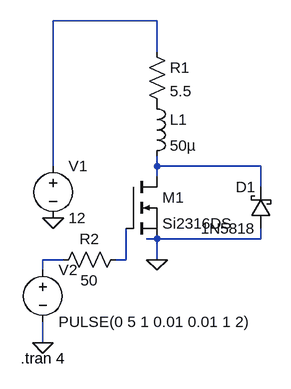
[diagram p0: schematic simu transitor.asc]
simu transitor.asc, the LTspice schematic file:
Version 4
SHEET 1 880 680
WIRE 224 -208 64 -208
WIRE 224 -160 224 -208
WIRE 64 16 64 -208
WIRE 224 16 224 0
WIRE 384 16 224 16
WIRE 224 32 224 16
WIRE 384 48 384 16
WIRE 224 128 208 128
WIRE 384 128 384 112
WIRE 384 128 224 128
WIRE 80 160 48 160
WIRE 176 160 176 112
WIRE 176 160 160 160
WIRE 224 160 224 128
WIRE 48 176 48 160
WIRE 48 288 48 256
FLAG 224 160 0
FLAG 64 96 0
FLAG 48 288 0
SYMBOL nmos 176 32 R0
SYMATTR InstName M1
SYMATTR Value Si2316DS
SYMBOL voltage 64 0 R0
WINDOW 123 0 0 Left 0
WINDOW 39 0 0 Left 0
SYMATTR InstName V1
SYMATTR Value 12
SYMBOL ind 208 -96 R0
SYMATTR InstName L1
SYMATTR Value 50µ
SYMBOL res 208 -176 R0
SYMATTR InstName R1
SYMATTR Value 5.5
SYMBOL voltage 48 160 R0
WINDOW 123 0 0 Left 0
WINDOW 39 0 0 Left 0
SYMATTR InstName V2
SYMATTR Value PULSE(0 5 1 0.01 0.01 1 2)
SYMBOL res 176 144 R90
WINDOW 0 0 56 VBottom 2
WINDOW 3 32 56 VTop 2
SYMATTR InstName R2
SYMATTR Value 50
SYMBOL schottky 400 112 R180
WINDOW 0 24 64 Left 2
WINDOW 3 24 0 Left 2
SYMATTR InstName D1
SYMATTR Value 1N5818
SYMATTR Description Diode
SYMATTR Type diode
TEXT 14 312 Left 2 !.tran 4

The netlist it stands for:
* simu transitor.asc
M1 N002 N004 0 0 Si2316DS
V1 N001 0 12
L1 P001 N002 50µ
R1 N001 P001 5.5
V2 N003 0 PULSE(0 5 1 0.01 0.01 1 2)
R2 N004 N003 50
D1 0 N002 1N5818
.model D D
.lib standard.dio
.model NMOS NMOS
.model PMOS PMOS
.lib standard.mos
.tran 4
.backanno
.end